# EAGLE schematic multi_sensor_board_TSL230RD_TCS3200RD (EAGLE 6.5.0)
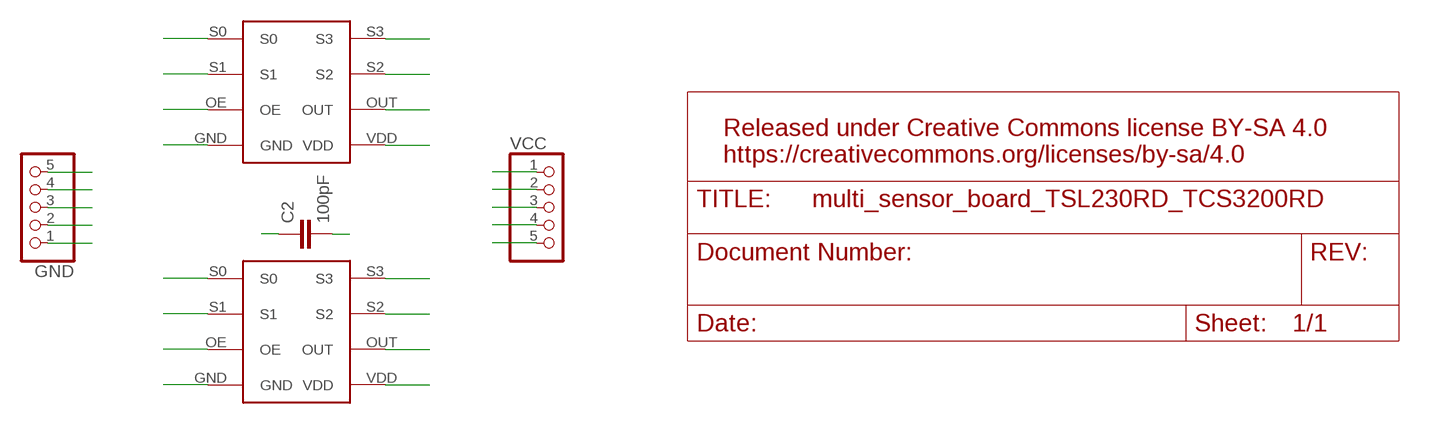
[diagram p0: schematic, sheet 1]

## Parts
C2  100pF  1.0UF-25V-+80/-20(0805)  [0805]
COLOR  TCS3200RD  TSL230RDSMD  [TSL230RD]
GND  PINHD-1X5  [1X05]
IR  TSL230R  TSL230RDSMD  [TSL230RD]
VCC  PINHD-1X5  [1X05]

## Nets
230-OE: IR.OE VCC.1
230-OUT: IR.OUT VCC.2
230-S0: GND.5 IR.S0
230-S1: GND.4 IR.S1
3200-OE: COLOR.OE GND.2
3200-OUT: COLOR.OUT GND.1
3200-S2: COLOR.S2 VCC.5
3200-S3: COLOR.S3 VCC.4
GND: C2.1 COLOR.GND COLOR.S0 GND.3 IR.GND IR.S3
VDD: C2.2 COLOR.S1 COLOR.VDD IR.S2 IR.VDD VCC.3

## Notes on the sheet
- Released under Creative Commons license BY-SA 4.0 
  https://creativecommons.org/licenses/by-sa/4.0

## Library data of the parts
C2 = SparkFun-Capacitors:1.0UF-25V-+80/-20(0805); PROD_ID: CAP-11625; VALUE: 1.0uF
COLOR IR = open_source_turbidimeter:TSL230RD
GND VCC = pinhead:PINHD-1X5: PIN HEADER